# EAGLE schematic bc-module-lcd (EAGLE 7.7.0)

## Sheet 1 of 2
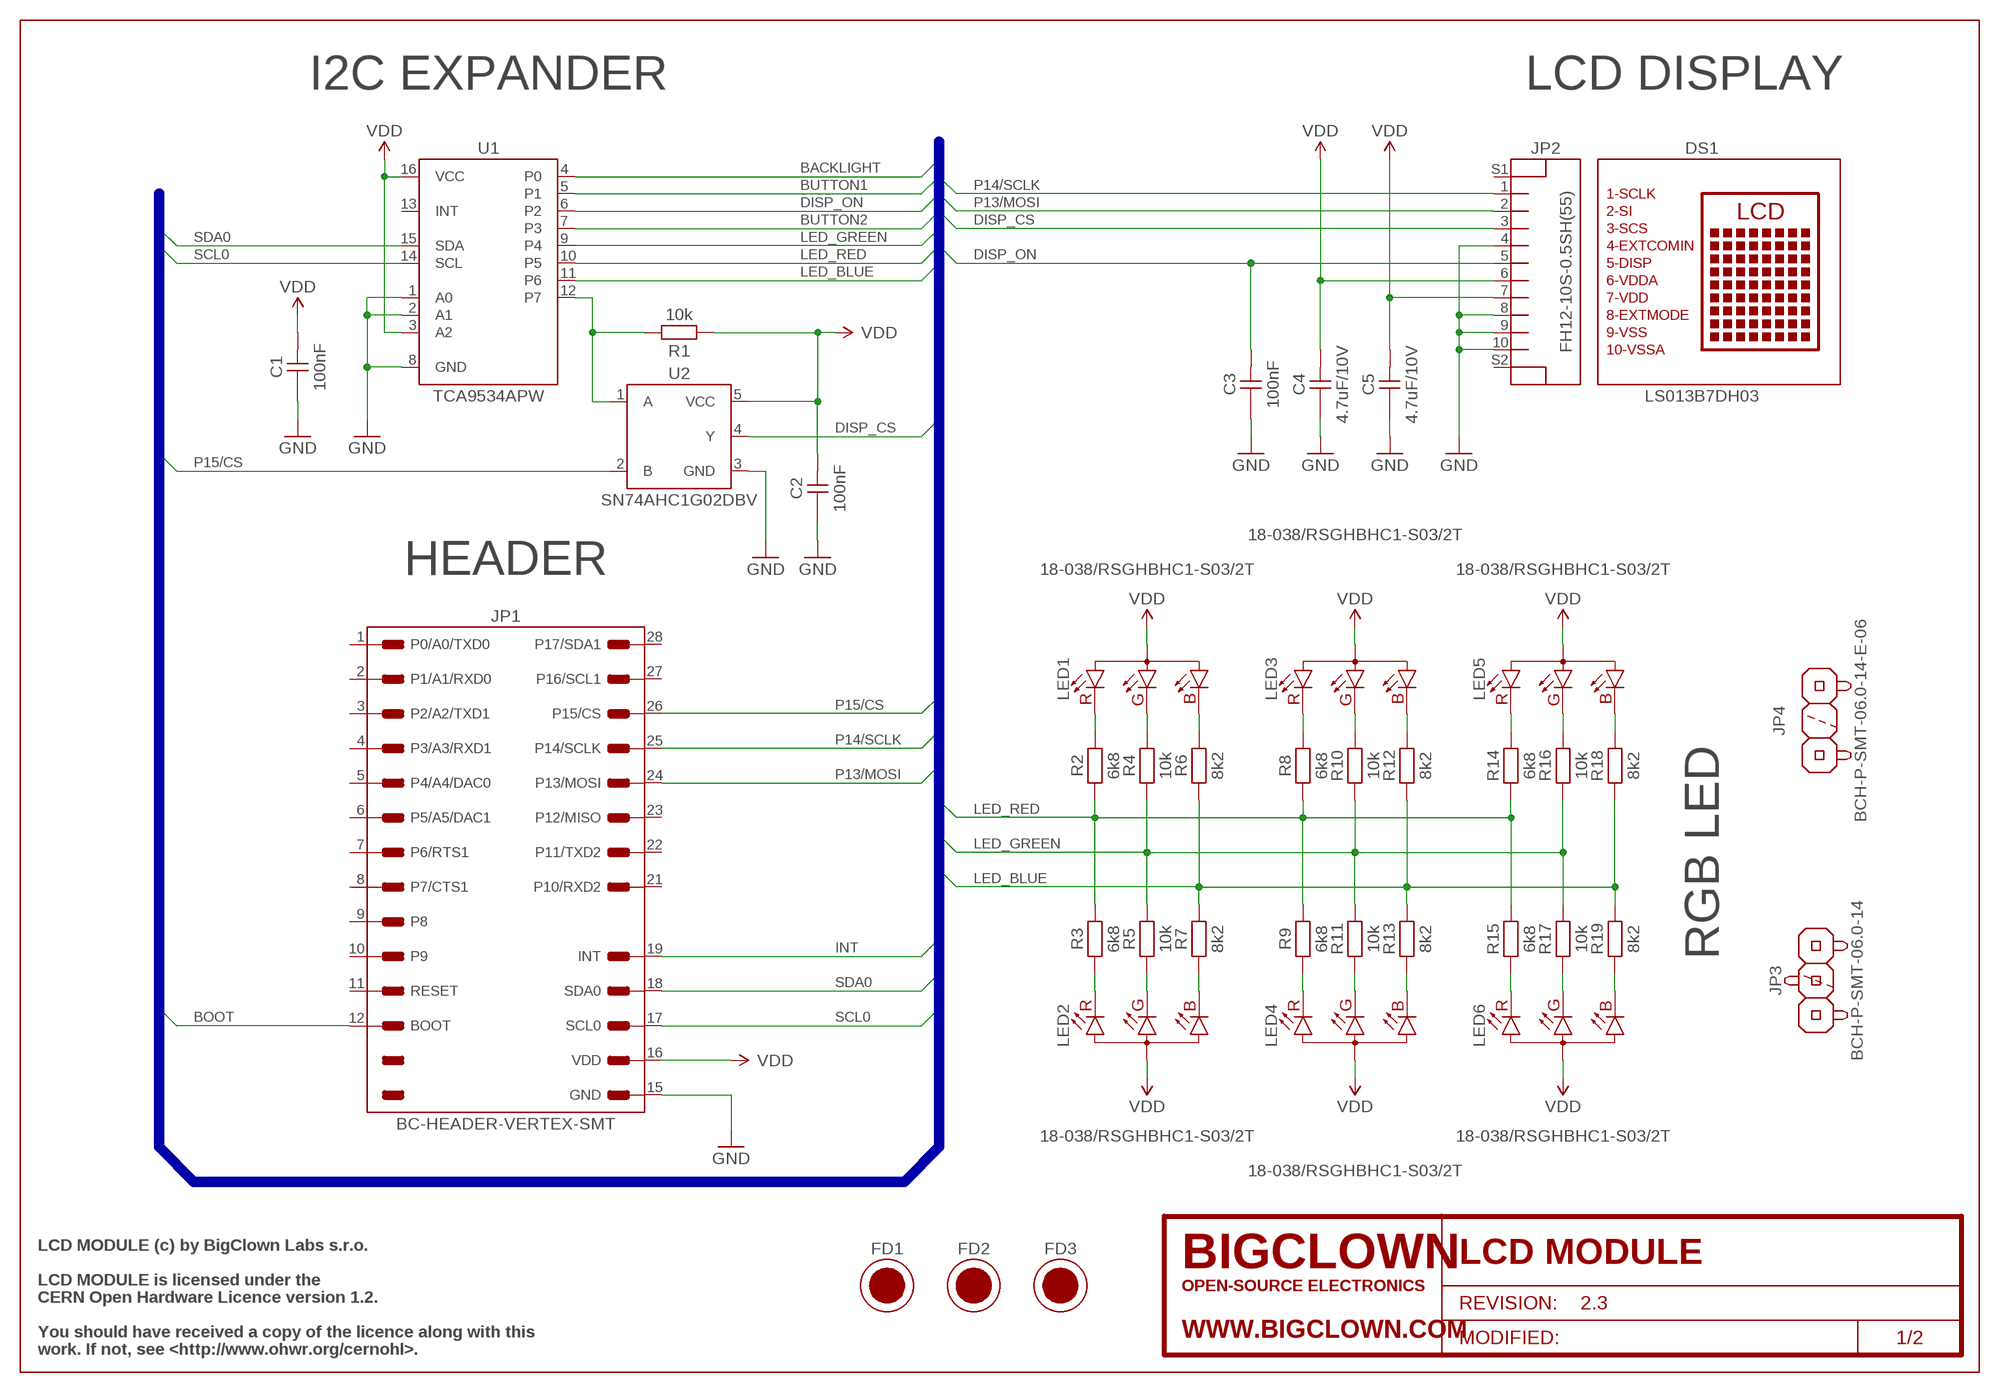
[diagram p0: schematic, sheet 1]

### Parts
C1  100nF  C-0603-100NF  [CAPACITOR-0603_R]
C2  100nF  C-0603-100NF  [CAPACITOR-0603_R]
C3  100nF  C-0603-100NF  [CAPACITOR-0603_R]
C4  4.7uF/10V  C-0603-4.7UF  [CAPACITOR-0603_R]
C5  4.7uF/10V  C-0603-4.7UF  [CAPACITOR-0603_R]
DS1  LS013B7DH03  DS-LS013B7DH03  [LS013B7DH03]
FD1  FIDUCIAL  [FIDUCIAL-1MM]
FD2  FIDUCIAL  [FIDUCIAL-1MM]
FD3  FIDUCIAL  [FIDUCIAL-1MM]
FRAME1  FRAME-SCH/A4L-BRD/A4L  [FRAME-A4L]
JP1  BC-HEADER-VERTEX-SMT  [BC-HEADER-VERTEX-SMT]
JP2  FH12-10S-0.5SH(55)  JP-FH12-10S-0.5SH(55)  [FH12-10S-0.5SH(55)_R]
JP3  BCH-P-SMT-06.0-14  JP-BCH-P-SMT-06.0-14  [BCH-P-SMT-14]
JP4  BCH-P-SMT-06.0-14-E-06  JP-BCH-P-SMT-06.0-14-E-06  [BCH-P-SMT-14-E-06]
LED1  18-038/RSGHBHC1-S03/2T  LED-18-038/RSGHBHC1-S03/2T  [LED-18-038/RSGHBHC1-S03/2T_R]
LED2  18-038/RSGHBHC1-S03/2T  LED-18-038/RSGHBHC1-S03/2T  [LED-18-038/RSGHBHC1-S03/2T_R]
LED3  18-038/RSGHBHC1-S03/2T  LED-18-038/RSGHBHC1-S03/2T  [LED-18-038/RSGHBHC1-S03/2T_R]
LED4  18-038/RSGHBHC1-S03/2T  LED-18-038/RSGHBHC1-S03/2T  [LED-18-038/RSGHBHC1-S03/2T_R]
LED5  18-038/RSGHBHC1-S03/2T  LED-18-038/RSGHBHC1-S03/2T  [LED-18-038/RSGHBHC1-S03/2T_R]
LED6  18-038/RSGHBHC1-S03/2T  LED-18-038/RSGHBHC1-S03/2T  [LED-18-038/RSGHBHC1-S03/2T_R]
R1  10k  R-0603-10K  [RESISTOR-0603_R]
R2  6k8  R-0402-6K8  [RESISTOR-0402_R]
R3  6k8  R-0402-6K8  [RESISTOR-0402_R]
R4  10k  R-0402-10K  [RESISTOR-0402_R]
R5  10k  R-0402-10K  [RESISTOR-0402_R]
R6  8k2  R-0402-8K2  [RESISTOR-0402_R]
R7  8k2  R-0402-8K2  [RESISTOR-0402_R]
R8  6k8  R-0402-6K8  [RESISTOR-0402_R]
R9  6k8  R-0402-6K8  [RESISTOR-0402_R]
R10  10k  R-0402-10K  [RESISTOR-0402_R]
R11  10k  R-0402-10K  [RESISTOR-0402_R]
R12  8k2  R-0402-8K2  [RESISTOR-0402_R]
R13  8k2  R-0402-8K2  [RESISTOR-0402_R]
R14  6k8  R-0402-6K8  [RESISTOR-0402_R]
R15  6k8  R-0402-6K8  [RESISTOR-0402_R]
R16  10k  R-0402-10K  [RESISTOR-0402_R]
R17  10k  R-0402-10K  [RESISTOR-0402_R]
R18  8k2  R-0402-8K2  [RESISTOR-0402_R]
R19  8k2  R-0402-8K2  [RESISTOR-0402_R]
U1  TCA9534APW  U-TCA9534APW  [TCA9534APW_R]
U2  SN74AHC1G02DBV  U-SN74AHC1G02DBV  [SN74AHC1G02DBV_R]

### Nets
BACKLIGHT: U1.4(P0) ; also sheet 2
BOOT: JP1.12(BOOT) ; also sheet 2
BUTTON1: U1.5(P1) ; also sheet 2
BUTTON2: U1.7(P3) ; also sheet 2
DISP_CS: JP2.3 U2.4(Y)
DISP_ON: C3.1 JP2.5 U1.6(P2)
GND: C1.2 C2.2 C3.2 C4.2 C5.2 JP1.15(GND) JP2.4 JP2.8 JP2.9 JP2.10 U1.1(A0) U1.2(A1) U1.8(GND) U2.3(GND) ; also sheet 2
INT: JP1.19(INT) ; also sheet 2
LED_BLUE: R6.1 R7.1 R12.1 R13.1 R18.1 R19.1 U1.11(P6)
LED_BLUE_R6: LED1.4(C_B) R6.2
LED_BLUE_R7: LED2.4(C_B) R7.2
LED_BLUE_R12: LED3.4(C_B) R12.2
LED_BLUE_R13: LED4.4(C_B) R13.2
LED_BLUE_R18: LED5.4(C_B) R18.2
LED_BLUE_R19: LED6.4(C_B) R19.2
LED_GREEN: R4.1 R5.1 R10.1 R11.1 R16.1 R17.1 U1.9(P4)
LED_GREEN_R4: LED1.3(C_G) R4.2
LED_GREEN_R5: LED2.3(C_G) R5.2
LED_GREEN_R10: LED3.3(C_G) R10.2
LED_GREEN_R11: LED4.3(C_G) R11.2
LED_GREEN_R16: LED5.3(C_G) R16.2
LED_GREEN_R17: LED6.3(C_G) R17.2
LED_RED: R2.1 R3.1 R8.1 R9.1 R14.1 R15.1 U1.10(P5)
LED_RED_R2: LED1.2(C_R) R2.2
LED_RED_R3: LED2.2(C_R) R3.2
LED_RED_R8: LED3.2(C_R) R8.2
LED_RED_R9: LED4.2(C_R) R9.2
LED_RED_R14: LED5.2(C_R) R14.2
LED_RED_R15: LED6.2(C_R) R15.2
OR_A: R1.2 U1.12(P7) U2.1(A)
P13/MOSI: JP1.24(P13/MOSI) JP2.2
P14/SCLK: JP1.25(P14/SCLK) JP2.1
P15/CS: JP1.26(P15/CS) U2.2(B)
SCL0: JP1.17(SCL0) U1.14(SCL) ; also sheet 2
SDA0: JP1.18(SDA0) U1.15(SDA) ; also sheet 2
VDD: C1.1 C2.1 C4.1 C5.1 JP1.16(VDD) JP2.6 JP2.7 LED1.1(A) LED2.1(A) LED3.1(A) LED4.1(A) LED5.1(A) LED6.1(A) R1.1 U1.3(A2) U1.16(VCC) U2.5(VCC) ; also sheet 2
Unconnected: JP1.1(P0/A0/TXD0) JP1.2(P1/A1/RXD0) JP1.3(P2/A2/TXD1) JP1.4(P3/A3/RXD1) JP1.5(P4/A4/DAC0) JP1.6(P5/A5/DAC1) JP1.7(P6/RTS1) JP1.8(P7/CTS1) JP1.9(P8) JP1.10(P9) JP1.11(RESET) JP1.21(P10/RXD2) JP1.22(P11/TXD2) JP1.23(P12/MISO) JP1.27(P16/SCL1) JP1.28(P17/SDA1) JP2.S1 JP2.S2 U1.13(INT)

### Buses
SDA0,SCL0,INT,BOOT,P13/MOSI,P14/SCLK,P15/CS,DISP_ON,DISP_CS,LED_RED,LED_GREEN,LED_BLUE,BUTTON1,BUTTON2,BACKLIGHT

### Notes on the sheet
- I2C EXPANDER | LCD DISPLAY
- HEADER
- RGB LED
- LCD MODULE (c) by BigClown Labs s.r.o.
- LCD MODULE is licensed under the
- CERN Open Hardware Licence version 1.2.
- You should have received a copy of the licence along with this
- work. If not, see <http://www.ohwr.org/cernohl>.

## Sheet 2 of 2
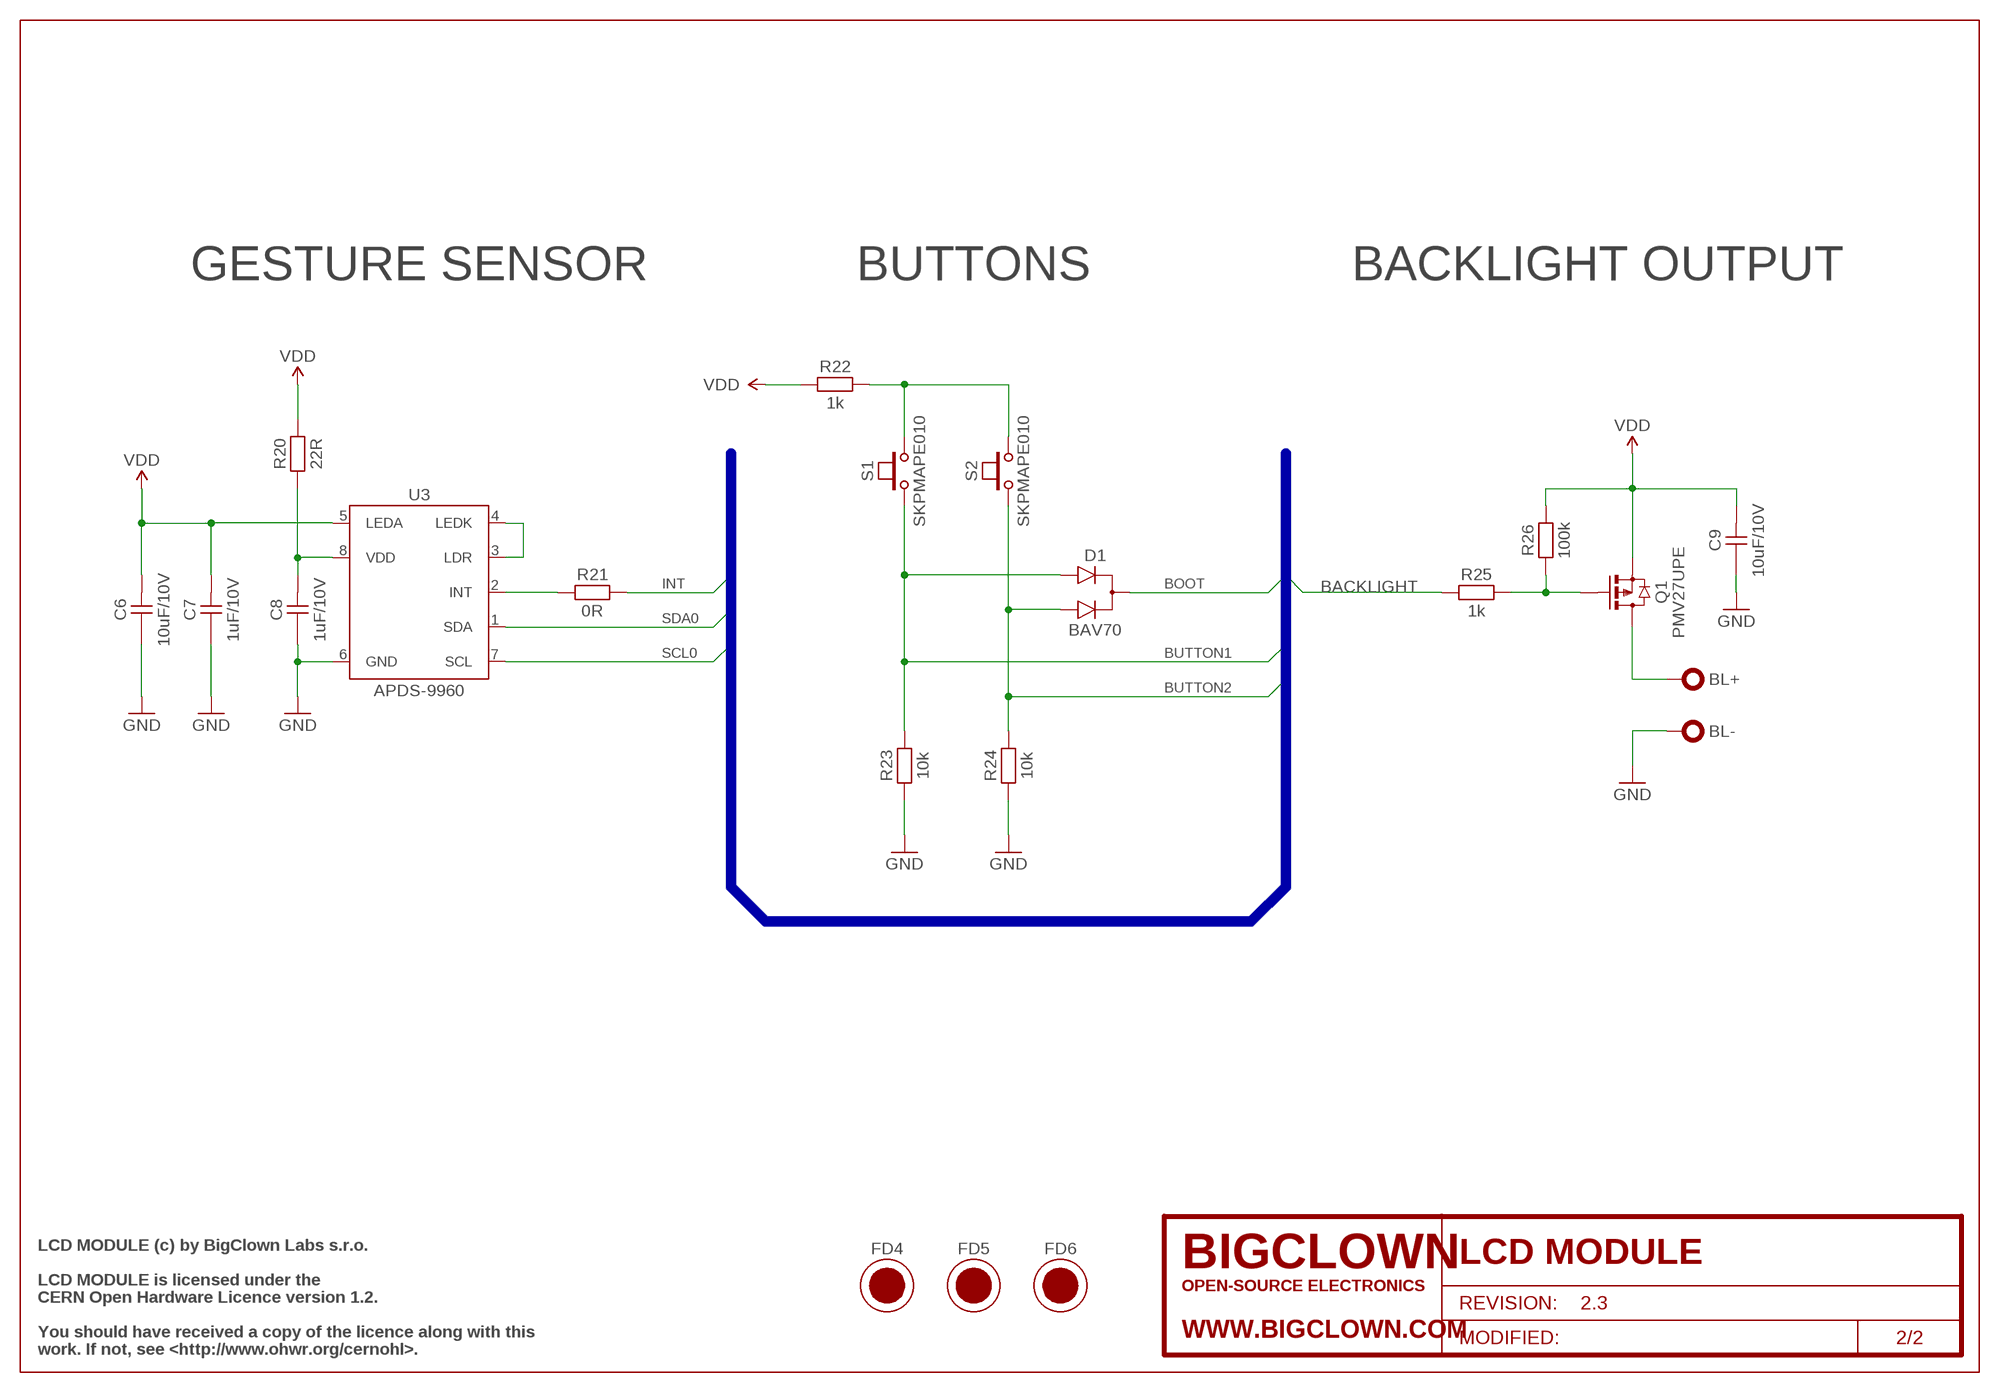
[diagram p1: schematic, sheet 2]
FRAME2 (FRAME-SCH/A4L-BRD/NONE): BCPN: -; PROJECT_NAME: LCD MODULE; PROJECT_REVISION: 2.3

### Parts
BL+  BC-HEADER-PIN-THT  [BC-HEADER-PIN-THT]
BL-  BC-HEADER-PIN-THT  [BC-HEADER-PIN-THT]
C6  10uF/10V  C-0603-10UF-10V  [CAPACITOR-0603_R]
C7  1uF/10V  C-0603-1UF-10V  [CAPACITOR-0603_R]
C8  1uF/10V  C-0603-1UF-10V  [CAPACITOR-0603_R]
C9  10uF/10V  C-0603-10UF-10V  [CAPACITOR-0603_R]
D1  BAV70  D-BAV70  [SOT-23_R]
FD4  FIDUCIAL  [FIDUCIAL-1MM]
FD5  FIDUCIAL  [FIDUCIAL-1MM]
FD6  FIDUCIAL  [FIDUCIAL-1MM]
Q1  PMV27UPE  Q-PMV27UPE  [SOT-23_R]
R20  22R  R-0603-22R  [RESISTOR-0603_R]
R21  0R  R-0603-0R  [RESISTOR-0603_R]
R22  1k  R-0603-1K  [RESISTOR-0603_R]
R23  10k  R-0603-10K  [RESISTOR-0603_R]
R24  10k  R-0603-10K  [RESISTOR-0603_R]
R25  1k  R-0603-1K  [RESISTOR-0603_R]
R26  100k  R-0603-100K  [RESISTOR-0603_R]
S1  SKPMAPE010  S-SKPMAPE010  [SKPMAPE010_R]
S2  SKPMAPE010  S-SKPMAPE010  [SKPMAPE010_R]
U3  APDS-9960  S-APDS-9960  [APDS-9960_R]

### Nets
BACKLIGHT: R25.1 ; also sheet 1
BACKLIGHT+: BL+.0 Q1.3(D)
BACKLIGHT_ON_G: Q1.1(G) R25.2 R26.1
BOOT: D1.3(C) ; also sheet 1
BUTTON1: D1.1(A1) R23.2 S1.1 ; also sheet 1
BUTTON2: D1.2(A2) R24.2 S2.1 ; also sheet 1
GND: BL-.0 C6.2 C7.2 C8.2 C9.2 R23.1 R24.1 U3.6(GND) ; also sheet 1
INT: R21.2 ; also sheet 1
INT_U3: R21.1 U3.2(INT)
N$3: U3.3(LDR) U3.4(LEDK)
N$5: R22.2 S1.2 S2.2
SCL0: U3.7(SCL) ; also sheet 1
SDA0: U3.1(SDA) ; also sheet 1
VDD: C6.1 C7.1 C9.1 Q1.2(S) R20.1 R22.1 R26.2 U3.5(LEDA) ; also sheet 1
VDD_U3: C8.1 R20.2 U3.8(VDD)

### Buses
SDA0,SCL0,INT,BOOT,P13/MOSI,P14/SCLK,P15/CS,DISP_ON,DISP_CS,BUTTON1,BUTTON2,BACKLIGHT

### Notes on the sheet
- GESTURE SENSOR | BUTTONS | BACKLIGHT OUTPUT
- LCD MODULE (c) by BigClown Labs s.r.o.
- LCD MODULE is licensed under the
- CERN Open Hardware Licence version 1.2.
- You should have received a copy of the licence along with this
- work. If not, see <http://www.ohwr.org/cernohl>.

## Library data of the parts
BL+ BL- = bc-header:BC-HEADER-PIN-THT; BCPN: -
C1-C3 = bc-capacitor:C-0603-100NF; BCPN: BC-C-0603-100NF
C4 C5 = bc-capacitor:C-0603-4.7UF; BCPN: BC-C-0603-4.7UF
C6 C9 = bc-capacitor:C-0603-10UF-10V; BCPN: BC-C-0603-10UF-10V
C7 C8 = bc-capacitor:C-0603-1UF-10V; BCPN: BC-C-0603-1UF-10V
D1 = bc-discrete:D-BAV70; BCPN: BC-D-BAV70
DS1 = bc-display:DS-LS013B7DH03; BCPN: BC-DS-LS013B7DH03
FD1-FD6 = bc-fiducial:FIDUCIAL; BCPN: -
FRAME1 = bc-frame:FRAME-SCH/A4L-BRD/A4L; BCPN: -; PROJECT_NAME: LCD MODULE; PROJECT_REVISION: 2.3
JP1 = bc-header:BC-HEADER-VERTEX-SMT; BCPN: -
JP2 = bc-connector:JP-FH12-10S-0.5SH(55); BCPN: BC-JP-FH12-10S-0.5SH(55)
JP3 = bc-header:JP-BCH-P-SMT-06.0-14; BCPN: BC-JP-BCH-P-SMT-06.0-14
JP4 = bc-header:JP-BCH-P-SMT-06.0-14-E-06; BCPN: BC-JP-BCH-P-SMT-06.0-14-E-06
LED1-LED6 = bc-led:LED-18-038/RSGHBHC1-S03/2T; BCPN: BC-LED-18-038/RSGHBHC1-S03/2T
Q1 = bc-discrete:Q-PMV27UPE; BCPN: BC-Q-PMV27UPE
R1 R23 R24 = bc-resistor:R-0603-10K; BCPN: BC-R-0603-10k
R2 R3 R8 R9 R14 R15 = bc-resistor:R-0402-6K8; BCPN: BC-R-0402-6K8
R4 R5 R10 R11 R16 R17 = bc-resistor:R-0402-10K; BCPN: BC-R-0402-10K
R6 R7 R12 R13 R18 R19 = bc-resistor:R-0402-8K2; BCPN: BC-R-0402-8K2
R20 = bc-resistor:R-0603-22R; BCPN: BC-R-0603-22R
R21 = bc-resistor:R-0603-0R; BCPN: BC-R-0603-0R
R22 R25 = bc-resistor:R-0603-1K; BCPN: BC-R-0603-1k
R26 = bc-resistor:R-0603-100K; BCPN: BC-R-0603-100k
S1 S2 = bc-switch:S-SKPMAPE010; BCPN: BC-S-SKPMAPE010
U1 = bc-interface:U-TCA9534APW; BCPN: BC-U-TCA9534APW
U2 = bc-logic:U-SN74AHC1G02DBV; BCPN: BC-U-SN74AHC1G02DBV
U3 = bc-sensor:S-APDS-9960; BCPN: BC-U-APDS-9960